# EAGLE design Xbee SX (EAGLE 8.2.2)
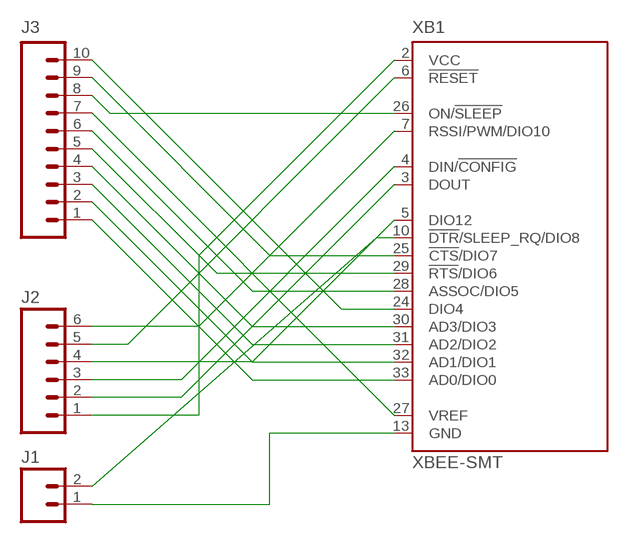
[diagram p0: schematic, sheet 1]

## Parts
J1  M02PTH  [1X02]
J2  M06SILK_FEMALE_PTH  [1X06]
J3  M10SILK_FEMALE_PTH  [1X10]
XB1  XBEE-SMT  [XBEE-SMT]

## Nets
GND: J1.1 XB1.13(GND)
N$1: J3.10 XB1.24(DIO4)
N$2: J3.9 XB1.25(!CTS!/DIO7)
N$3: J3.8 XB1.26(ON/!SLEEP)
N$4: J3.7 XB1.27(VREF)
N$5: J3.6 XB1.28(ASSOC/DIO5)
N$6: J3.5 XB1.29(!RTS!/DIO6)
N$7: J3.4 XB1.30(AD3/DIO3)
N$8: J3.3 XB1.31(AD2/DIO2)
N$9: J3.2 XB1.32(AD1/DIO1)
N$10: J3.1 XB1.33(AD0/DIO0)
N$11: J2.1 XB1.2(VCC)
N$12: J2.2 XB1.3(DOUT)
N$13: J2.3 XB1.4(DIN/!CONFIG)
N$14: J2.4 XB1.5(DIO12)
N$15: J2.5 XB1.6(!RESET)
N$16: J2.6 XB1.7(RSSI/PWM/DIO10)
N$17: J1.2 XB1.10(!DTR!/SLEEP_RQ/DIO8)

## Library data of the parts
J1 = SparkFun-Connectors:M02: Standard 2-pin 0.1" header. Use with - straight break away headers ( PRT-00116) - right angle break away headers (PRT-00553) - swiss pins (PRT-00743) - machine pins (PRT-00117) - female headers (PRT-00115) Molex polarized connector foot print use with: PRT-08233 with associated crimp pins and housings. 2.54_SCREWTERM for use with PRT-10571. 3.5mm Screw Terminal footprints for PRT-08084 5mm Screw Terminal footprints for use with PRT-08432
J2 = SparkFun-Connectors:M06: Header 6 Standard 6-pin 0.1" header. Use with straight break away headers (SKU : PRT-00116), right angle break away headers (PRT-00553), swiss pins (PRT-00743), machine pins (PRT-00117), and female headers (PRT-00115). Molex polarized connector foot print use with SKU : PRT-08094 with associated crimp pins and housings. NOTES ON THE VARIANTS LOCK and LOCK_LONGPADS... This footprint was designed to help hold the alignment of a through-hole component (i.e. 6-pin header) while soldering it into place. You may notice that each hole has been shifted either up or down by 0.005 of an inch from it's more standard position (which is a perfectly straight line). This slight alteration caused the pins (the squares in the middle) to touch the edges of the holes. Because they are alternating, it causes a "brace" to hold the component in place. 0.005 has proven to be the perfect amount of "off-center" position when using our standard breakaway headers. Although looks a little odd when you look at the bare footprint, once you have a header in there, the alteration is very hard to notice. Also,if you push a header all the way into place, it is covered up entirely on the bottom side. This idea of altering the position of holes to aid alignment will be further integrated into the Sparkfun Library for other footprints. It can help hold any component with 3 or more connection pins.; PROD_ID: CONN-08437
J3 = SparkFun-Connectors:M10: Header 10 Standard 10-pin 0.1" header. Use with straight break away headers (SKU : PRT-00116), right angle break away headers (PRT-00553), swiss pins (PRT-00743), machine pins (PRT-00117), and female headers (PRT-00115).; PROD_ID: CONN-11563
XB1 = xbee:XBEE-SMT: XBee(TM)/XBee-PRO(TM) ZB SMT RF Modules. Source: Digi (90002002_a.pdf) (http://www.digi.com/products/wireless-wired-embedded-solutions/zigbee-rf-modules/zigbee-mesh-module/xbee-smt.jsp#overview)

## Board
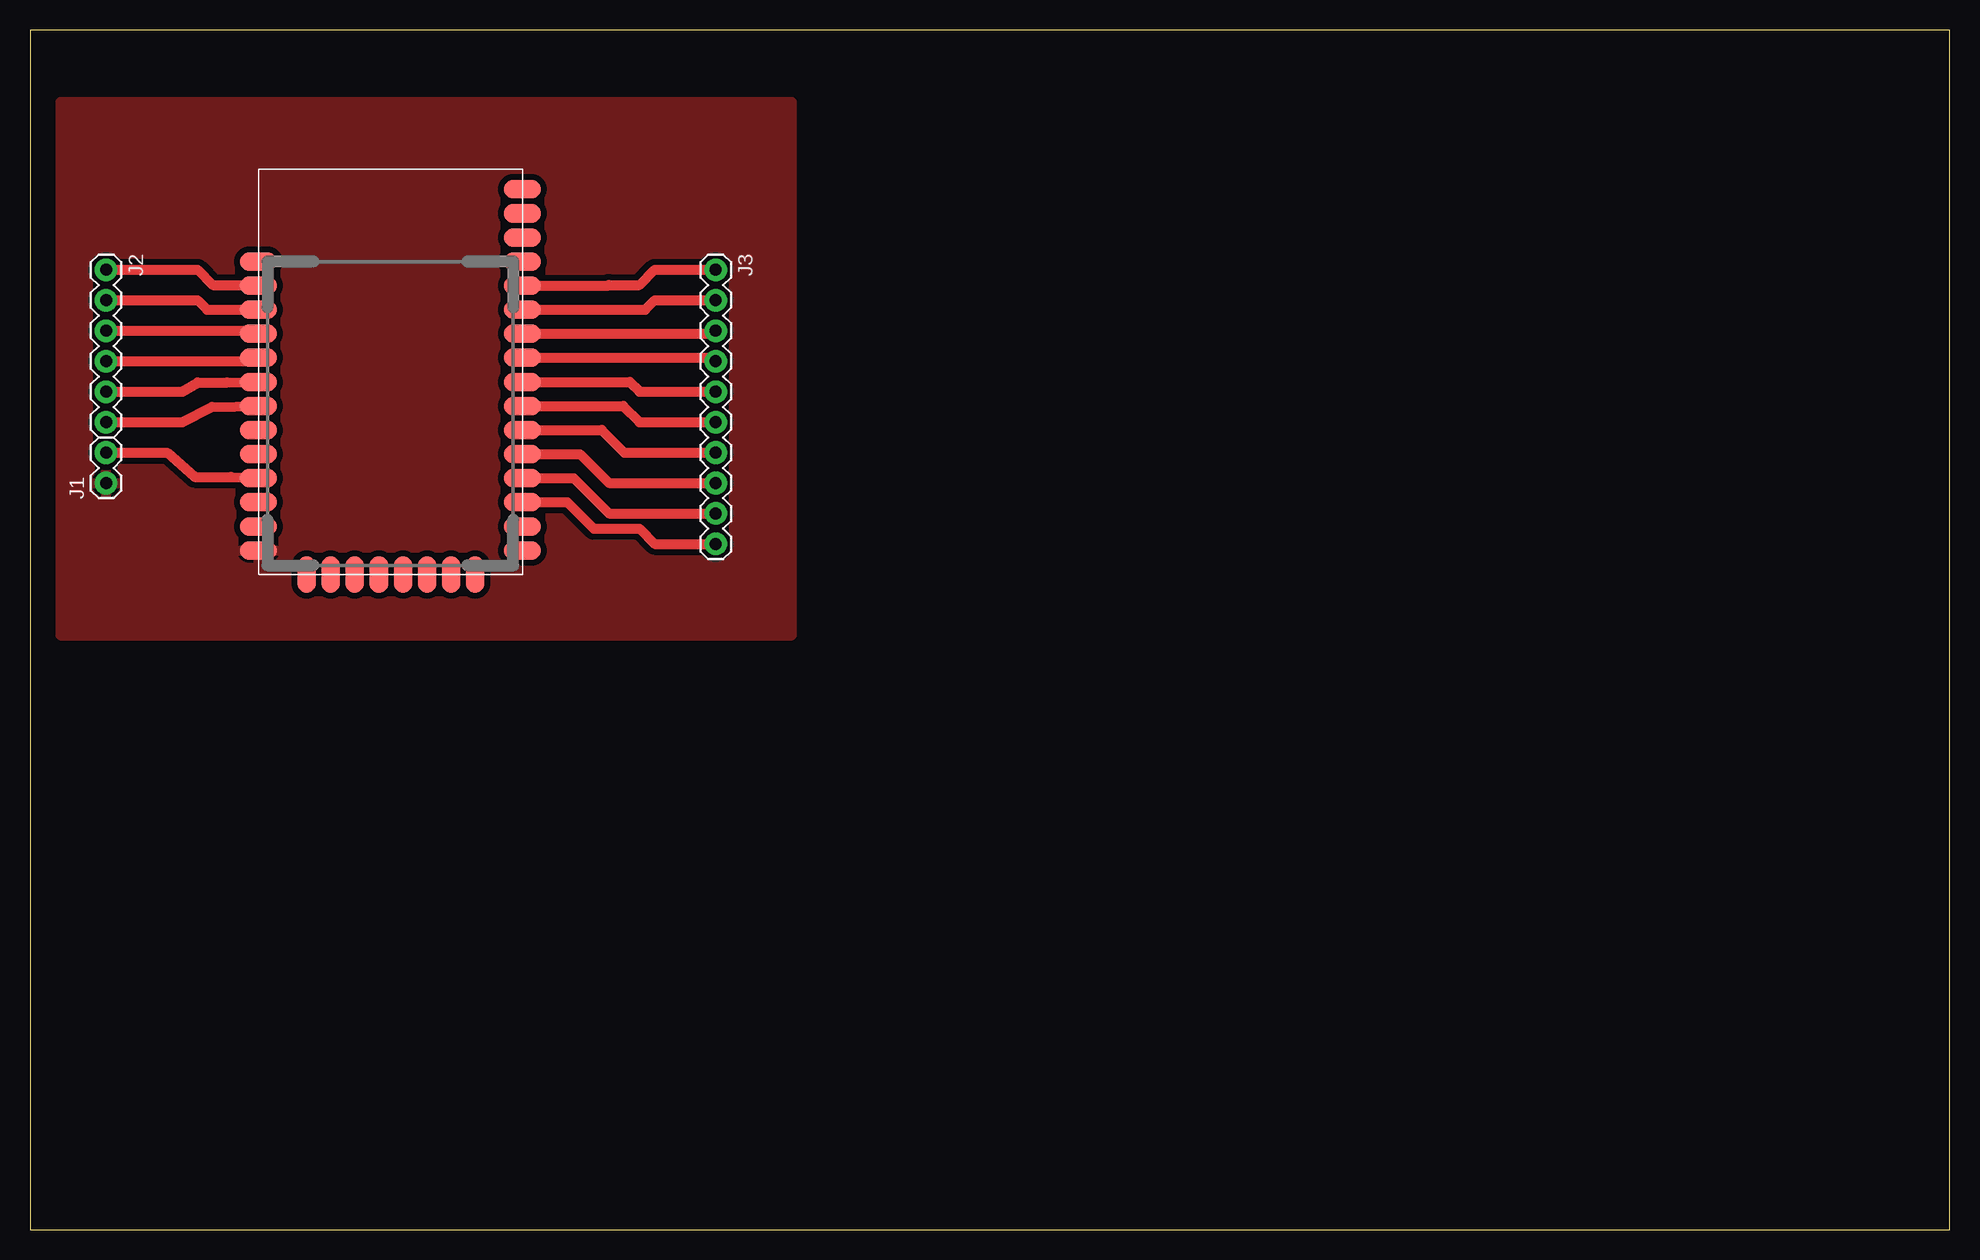
[diagram p1: board, top side]

Size 160 x 100 mm. Coordinates in mm from the lower left corner, seen from the top.
Outline: 0,0 160,0 160,100 0,100 0,0
Copper layers (1*16): Top 0.035mm / dielectric 1.5mm / Bottom 0.035mm
Design rules "default": minimum track width 6mil, minimum drill 0.35mm, track to track 6mil, track to pad 6mil, pad to pad 6mil, via to via 6mil, smd to smd 6mil, copper to edge 40mil, drill to drill 6mil, minimum pad ring 10mil, minimum via ring 8mil, stop-mask expansion 4mil, vias tented up to drill 0mil, thermal gap 10mil

### Footprints (pad centres in the part's own frame; a part is rotated, then mirrored left to right if it is on the bottom)
1X02 = drill 1.016 pad 1.88: 1 0,0; 2 2.54,0
1X06 = drill 1.016 pad 1.88: 1 0,0; 2 2.54,0; 3 5.08,0; 4 7.62,0; 5 10.16,0; 6 12.7,0
1X10 = drill 1.016 pad 1.88: 1 0,0; 2 2.54,0; 3 5.08,0; 4 7.62,0; 5 10.16,0; 6 12.7,0; 7 15.24,0; 8 17.78,0; 9 20.32,0; 10 22.86,0
XBEE-SMT = smd 3.048 x 1.524: 1 0,26.086; 2 0,24.079; 3 0,22.073; 4 0,20.066; 5 0,18.059; 6 0,16.053; 7 0,14.046; 8 0,12.04; 9 0,10.033; 10 0,8.026; 11 0,6.02; 12 0,4.013; 13 0,2.007; 22 21.996,2.007; 23 21.996,4.013; 24 21.996,6.02; 25 21.996,8.026; 26 21.996,10.033; 27 21.996,12.04; 28 21.996,14.046; 29 21.996,16.053; 30 21.996,18.059; 31 21.996,20.066; 32 21.996,22.073; 33 21.996,24.079; 34 21.996,26.086; 35 21.996,28.092; 36 21.996,30.099; 37 21.996,32.106 | smd 1.524 x 3.048: 14 4.013,0; 15 6.02,0; 16 8.026,0; 17 10.033,0; 18 12.04,0; 19 14.046,0; 20 16.053,0; 21 18.059,0

### Placement (x,y rotation side)
J1  6.35,62.23 90 top
J2  6.35,80.01 270 top
J3  57.15,80.01 270 top
XB1  19.05,54.61 0 top

### Tracks (layer width: path | path; a pad name or v marks a point on that pad's centre or on a via)
GND
  pour Top (isolate 0.508): 2.54,93.98 2.54,49.53 63.5,49.53 63.5,93.98
N$1
  Top 0.813: XB1.24 44.78,60.63 46.99,58.42 50.8,58.42 52.07,57.15 J3.10
N$2
  Top 0.813: XB1.25 45.31,62.64 48.26,59.69 J3.9
N$3
  Top 0.813: XB1.26 45.85,64.64 48.26,62.23 J3.8
N$4
  Top 0.813: XB1.27 47.65,66.65 49.53,64.77 J3.7
N$5
  Top 0.813: XB1.28 49.45,68.66 50.8,67.31 J3.6
N$6
  Top 0.813: XB1.29 49.99,70.66 50.8,69.85 J3.5
N$7
  Top 0.813: XB1.30 56.87,72.67 J3.4
N$8
  Top 0.813: XB1.31 56.9,74.68 J3.3
N$9
  Top 0.813: XB1.32 51.28,76.68 52.07,77.47 J3.2
N$10
  Top 0.813: XB1.33 48.21,78.69 48.26,78.74 50.8,78.74 52.07,80.01 J3.1
N$11
  Top 0.813: 19.05,78.74 XB1.2 19,78.74 15.24,78.74 13.97,80.01 J2.1
N$12
  Top 0.813: J2.2 13.97,77.47 14.76,76.68 XB1.3
N$13
  Top 0.813: J2.3 18.8,74.93 XB1.4
N$14
  Top 0.813: J2.4 18.77,72.39 XB1.5
N$15
  Top 0.813: J2.5 12.7,69.85 13.97,70.61 16.43,70.61 XB1.6
N$16
  Top 0.813: J2.6 12.7,67.31 15.16,68.58 XB1.7
N$17
  Top 0.813: J1.2 11.43,64.77 13.72,62.74 16.74,62.74 XB1.10